# Altium schematic sheet sz1v5.SchDoc
size A; SheetNumber: 1; SheetTotal: 1
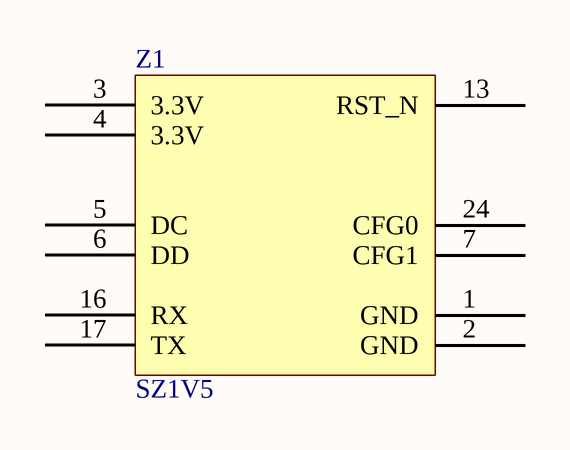
[diagram p0: sz1v5.SchDoc]

## Parts
Z1  SZ1V5  [SZ1V5_PINOUT]

## Nets

Not connected (* = marked no-connect by the designer): Z1 1(GND) 2(GND) 3(3.3V) 4(3.3V) 5(DC) 6(DD) 7(CFG1) 13(RST_N) 16(RX) 17(TX) 24(CFG0)

## Library data of the parts
Z1 = SZ1V5_Alt